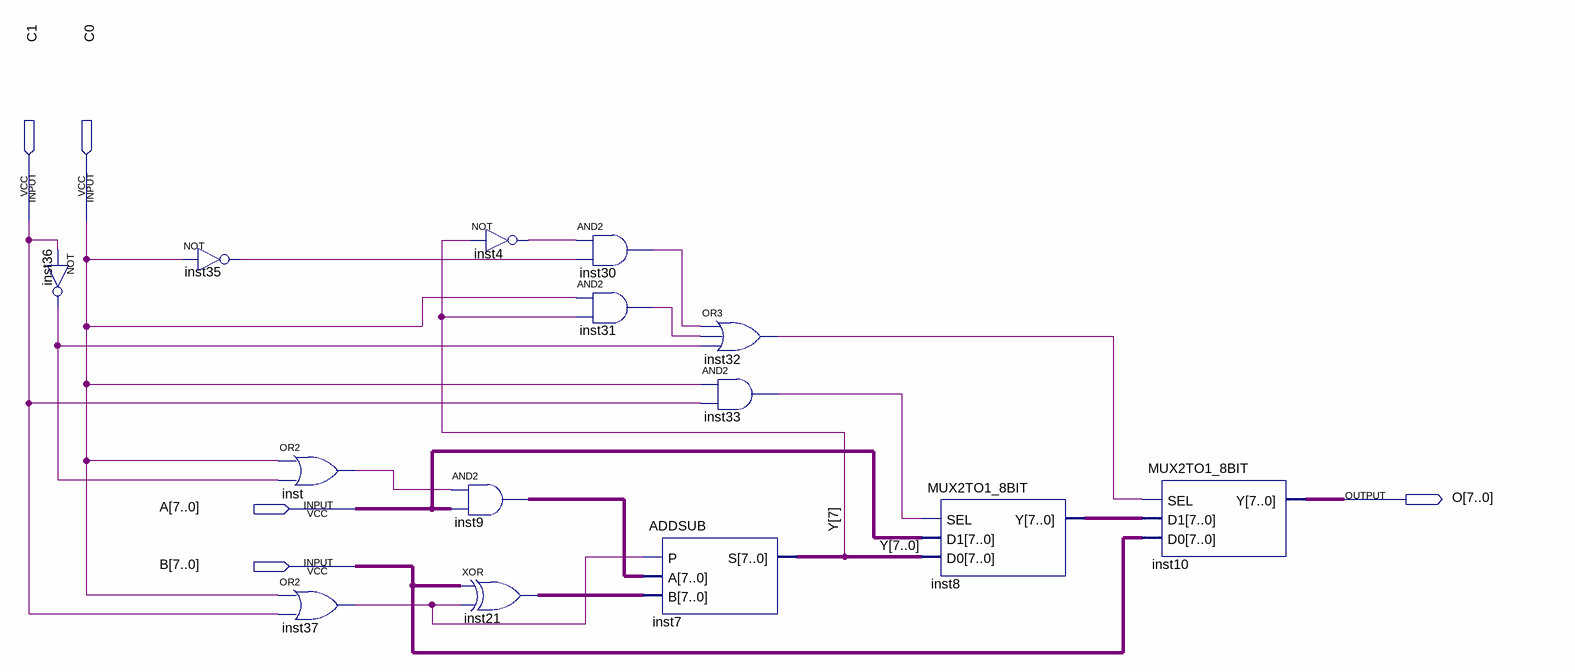
[diagram p0: schematic sheet]
// Quartus schematic AbsMinSubAdd.bdf as structural Verilog: 14 symbols, 5 pins
module AbsMinSubAdd (
  input  C1,
  input  C0,
  input  [7:0] A,
  input  [7:0] B,
  output [7:0] O
);

  wire inst4_out, inst30_out, inst31_out, inst32_out, inst33_out, inst35_out, inst36_out, inst37_out,
       inst_out;
  wire [7:0] inst8_y, inst9_out, inst21_out, Y;

  not inst36 (inst36_out, C1);
  not inst35 (inst35_out, C0);
  or inst (inst_out, C0, inst36_out);
  or inst37 (inst37_out, C0, C1);
  not inst4 (inst4_out, Y[7]);
  assign inst9_out = {8{inst_out}} & A;  // AND2 inst9, 8 bits wide
  assign inst21_out = B ^ {8{inst37_out}};  // XOR inst21, 8 bits wide
  and inst30 (inst30_out, inst4_out, inst35_out);
  and inst31 (inst31_out, C0, Y[7]);
  ADDSUB inst7 (.P(inst37_out), .A(inst9_out), .B(inst21_out), .S(Y));
  or inst32 (inst32_out, inst30_out, inst31_out, inst36_out);
  and inst33 (inst33_out, C0, C1);
  MUX2TO1_8BIT inst8 (.SEL(inst33_out), .D1(A), .D0(Y), .Y(inst8_y));
  MUX2TO1_8BIT inst10 (.SEL(inst32_out), .D1(inst8_y), .D0(B), .Y(O));
endmodule
